# EAGLE design bff-stm32f4-codec (EAGLE 9.4.2)
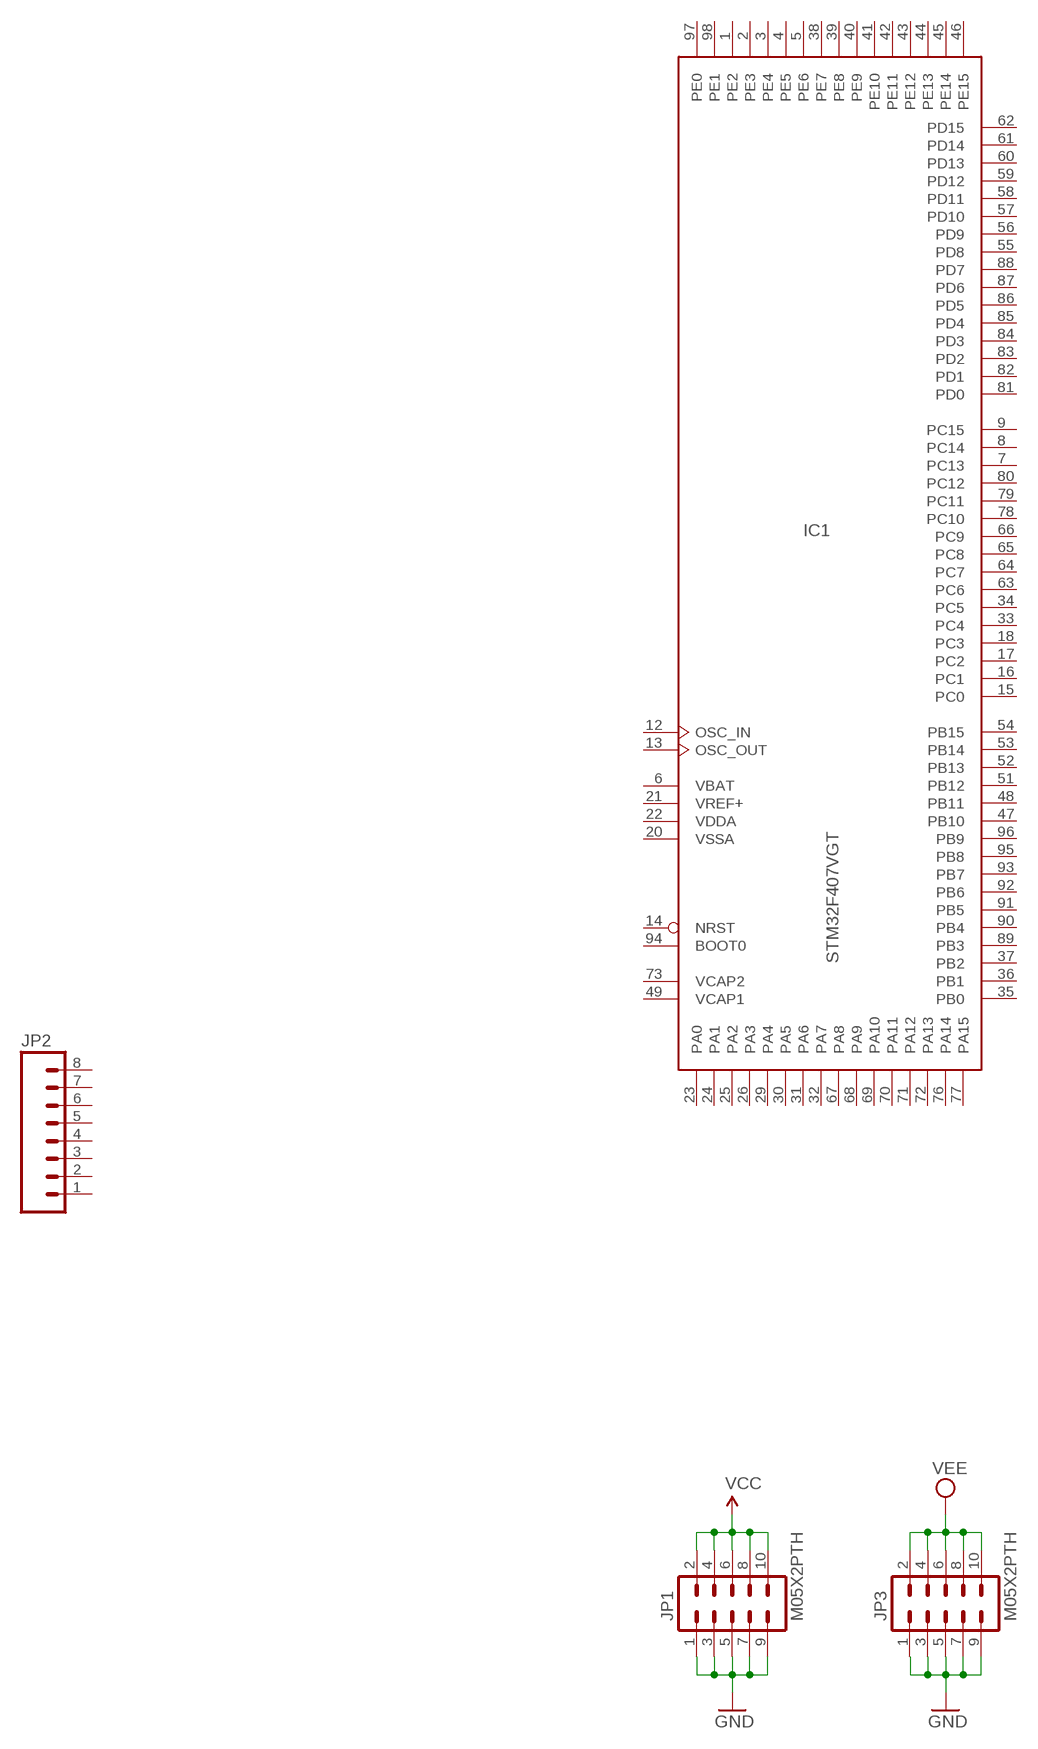
[diagram p0: schematic, sheet 1]

## Parts
IC1  STM32F407VGT  [LQFP100]
JP1  M05X2PTH  [AVR_ICSP]
JP2  M08  [1X08]
JP3  M05X2PTH  [AVR_ICSP]

## Nets
GND: JP1.1 JP1.3 JP1.5 JP1.7 JP1.9 JP3.1 JP3.3 JP3.5 JP3.7 JP3.9
VCC: JP1.2 JP1.4 JP1.6 JP1.8 JP1.10
VEE: JP3.2 JP3.4 JP3.6 JP3.8 JP3.10
Unconnected: IC1.1(PE2) IC1.2(PE3) IC1.3(PE4) IC1.4(PE5) IC1.5(PE6) IC1.7(PC13) IC1.8(PC14) IC1.9(PC15) IC1.12(OSC_IN) IC1.13(OSC_OUT) IC1.14(NRST) IC1.15(PC0) IC1.16(PC1) IC1.17(PC2) IC1.18(PC3) IC1.23(PA0) IC1.24(PA1) IC1.25(PA2) IC1.26(PA3) IC1.29(PA4) IC1.30(PA5) IC1.31(PA6) IC1.32(PA7) IC1.33(PC4) IC1.34(PC5) IC1.35(PB0) IC1.36(PB1) IC1.37(PB2) IC1.38(PE7) IC1.39(PE8) IC1.40(PE9) IC1.41(PE10) IC1.42(PE11) IC1.43(PE12) IC1.44(PE13) IC1.45(PE14) IC1.46(PE15) IC1.47(PB10) IC1.48(PB11) IC1.51(PB12) IC1.52(PB13) IC1.53(PB14) IC1.54(PB15) IC1.55(PD8) IC1.56(PD9) IC1.57(PD10) IC1.58(PD11) IC1.59(PD12) IC1.60(PD13) IC1.61(PD14) IC1.62(PD15) IC1.63(PC6) IC1.64(PC7) IC1.65(PC8) IC1.66(PC9) IC1.67(PA8) IC1.68(PA9) IC1.69(PA10) IC1.70(PA11) IC1.71(PA12) IC1.72(PA13) IC1.76(PA14) IC1.77(PA15) IC1.78(PC10) IC1.79(PC11) IC1.80(PC12) IC1.81(PD0) IC1.82(PD1) IC1.83(PD2) IC1.84(PD3) IC1.85(PD4) IC1.86(PD5) IC1.87(PD6) IC1.88(PD7) IC1.89(PB3) IC1.90(PB4) IC1.91(PB5) IC1.92(PB6) IC1.93(PB7) IC1.94(BOOT0) IC1.95(PB8) IC1.96(PB9) IC1.97(PE0) IC1.98(PE1) JP2.1 JP2.2 JP2.3 JP2.4 JP2.5 JP2.6 JP2.7 JP2.8

## Power pins joined to a net without a drawn wire
VBAT: IC1.6(VBAT)
VCAP1: IC1.49(VCAP1)
VCAP2: IC1.73(VCAP2)
VDD: IC1.11(VDD) IC1.19(VDD) IC1.28(VDD) IC1.50(VDD) IC1.75(VDD) IC1.100(VDD)
VDDA: IC1.22(VDDA)
VREF+: IC1.21(VREF+)
VSS: IC1.10(VSS) IC1.27(VSS) IC1.74(VSS) IC1.99(VSS)
VSSA: IC1.20(VSSA)

## Library data of the parts
IC1 = micro-stm_v3:STM32F407V*T: ARM 32-bit Cortex™-M3 CPU 168 MHz maximum frequency 512 to 1024 Kbytes of Flash memory 192 kbytes of SRAM 82 GPIOs 1.8 to 3.6 V application supply
JP1 JP3 = SparkFun:M05X2: Header 5x2 Standard 10-pin dual row 0.1" header. Commonly used with AVR-ISP. Use with Spark Fun Electronics SKU: PRT-00778
JP2 = SparkFun:M08: Header 8 Standard 8-pin 0.1" header. Use with straight break away headers (SKU : PRT-00116), right angle break away headers (PRT-00553), swiss pins (PRT-00743), machine pins (PRT-00117), and female headers (PRT-00115).

## Net classes
0 default: width 0.305 mm, drill 0.508 mm, clearance 0.254 mm

## Board
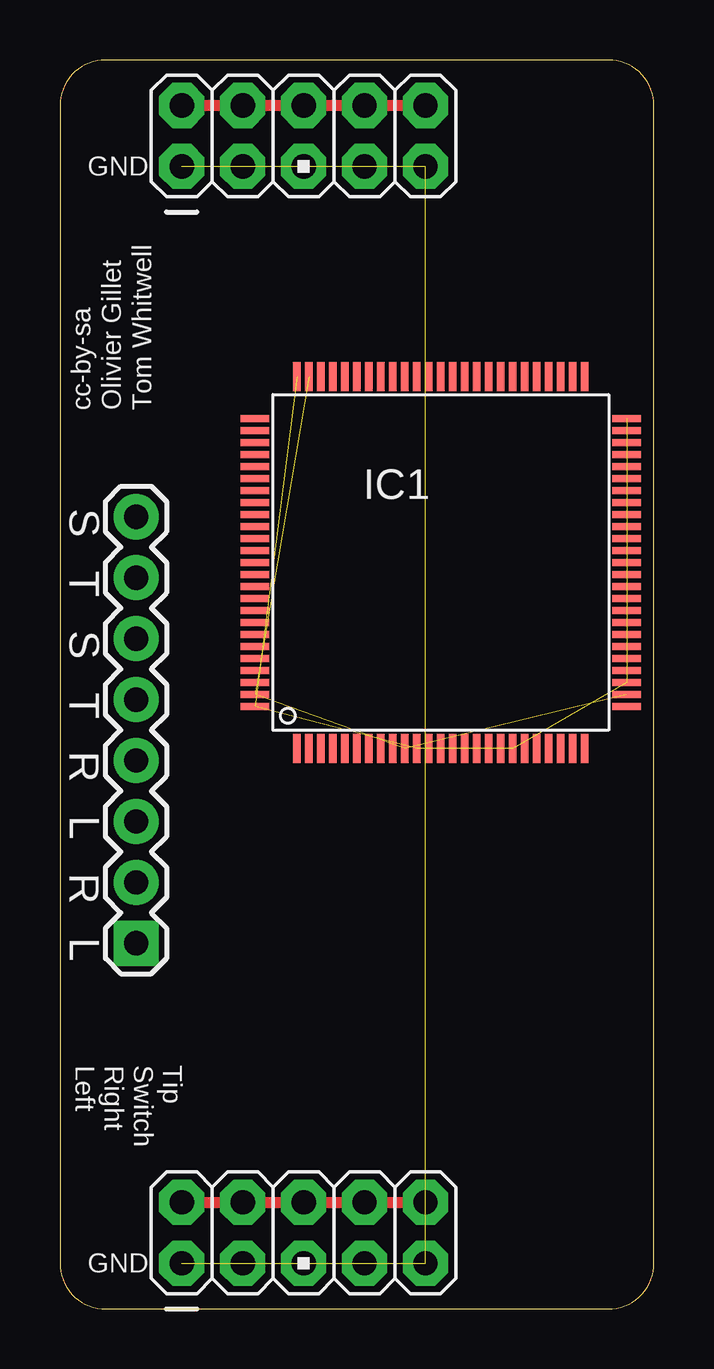
[diagram p1: board, top side]
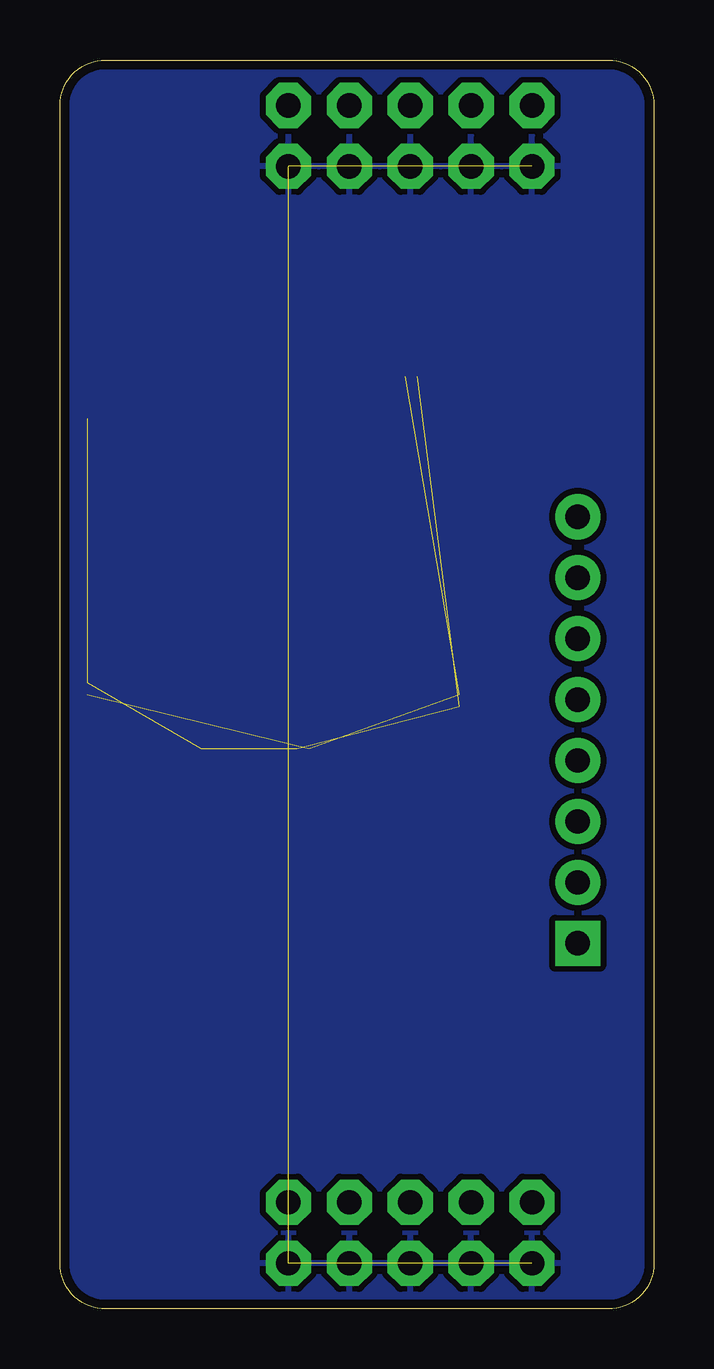
[diagram p2: board, bottom side, seen from below]

Size 24.76 x 52.06 mm. Coordinates in mm from the lower left corner, seen from the top.
Outline: 22.86,0 arc90 24.76,1.91 24.76,50.16 arc90 22.87,52.06 1.89,52.06 arc90 0,50.16 0,1.91 arc90 1.91,0 22.86,0
Copper layers (1*16): Top 0.035559375mm / dielectric 1.6mm / Bottom 0.035559375mm
Design rules "oshpark-2layer": minimum track width 6mil, minimum drill 10mil, track to track 6mil, track to pad 6mil, pad to pad 6mil, via to via 6mil, smd to smd 6mil, copper to edge 15mil, drill to drill 6mil, minimum pad ring 5mil, minimum via ring 5mil, stop-mask expansion 2.5mil, vias tented up to drill 0mil, thermal gap 10mil

### Footprints (pad centres in the part's own frame; a part is rotated, then mirrored left to right if it is on the bottom)
LQFP100 = smd 0.3 x 1.2: 1 -6,-7.75; 2 -5.5,-7.75; 3 -5,-7.75; 4 -4.5,-7.75; 5 -4,-7.75; 6 -3.5,-7.75; 7 -3,-7.75; 8 -2.5,-7.75; 9 -2,-7.75; 10 -1.5,-7.75; 11 -1,-7.75; 12 -0.5,-7.75; 13 0,-7.75; 14 0.5,-7.75; 15 1,-7.75; 16 1.5,-7.75; 17 2,-7.75; 18 2.5,-7.75; 19 3,-7.75; 20 3.5,-7.75; 21 4,-7.75; 22 4.5,-7.75; 23 5,-7.75; 24 5.5,-7.75; 25 6,-7.75; 51 6,7.75; 52 5.5,7.75; 53 5,7.75; 54 4.5,7.75; 55 4,7.75; 56 3.5,7.75; 57 3,7.75; 58 2.5,7.75; 59 2,7.75; 60 1.5,7.75; 61 1,7.75; 62 0.5,7.75; 63 0,7.75; 64 -0.5,7.75; 65 -1,7.75; 66 -1.5,7.75; 67 -2,7.75; 68 -2.5,7.75; 69 -3,7.75; 70 -3.5,7.75; 71 -4,7.75; 72 -4.5,7.75; 73 -5,7.75; 74 -5.5,7.75; 75 -6,7.75 | smd 1.2 x 0.3: 26 7.75,-6; 27 7.75,-5.5; 28 7.75,-5; 29 7.75,-4.5; 30 7.75,-4; 31 7.75,-3.5; 32 7.75,-3; 33 7.75,-2.5; 34 7.75,-2; 35 7.75,-1.5; 36 7.75,-1; 37 7.75,-0.5; 38 7.75,0; 39 7.75,0.5; 40 7.75,1; 41 7.75,1.5; 42 7.75,2; 43 7.75,2.5; 44 7.75,3; 45 7.75,3.5; 46 7.75,4; 47 7.75,4.5; 48 7.75,5; 49 7.75,5.5; 50 7.75,6; 76 -7.75,6; 77 -7.75,5.5; 78 -7.75,5; 79 -7.75,4.5; 80 -7.75,4; 81 -7.75,3.5; 82 -7.75,3; 83 -7.75,2.5; 84 -7.75,2; 85 -7.75,1.5; 86 -7.75,1; 87 -7.75,0.5; 88 -7.75,0; 89 -7.75,-0.5; 90 -7.75,-1; 91 -7.75,-1.5; 92 -7.75,-2; 93 -7.75,-2.5; 94 -7.75,-3; 95 -7.75,-3.5; 96 -7.75,-4; 97 -7.75,-4.5; 98 -7.75,-5; 99 -7.75,-5.5; 100 -7.75,-6
AVR_ICSP = drill 1.016 pad 1.88 octagon: 1 -1.27,5.08; 2 1.27,5.08; 3 -1.27,2.54; 4 1.27,2.54; 5 -1.27,0; 6 1.27,0; 7 -1.27,-2.54; 8 1.27,-2.54; 9 -1.27,-5.08; 10 1.27,-5.08
1X08 = drill 1.016 pad 1.88 square: 1 0,0 | drill 1.016 pad 1.88: 2 2.54,0; 3 5.08,0; 4 7.62,0; 5 10.16,0; 6 12.7,0; 7 15.24,0; 8 17.78,0

### Placement (x,y rotation side)
IC1  15.88,31.11 0 top
JP1  10.16,48.9 90 top
JP2  3.17,15.24 90 top
JP3  10.16,3.17 90 top

### Tracks (layer width: path | path; a pad name or v marks a point on that pad's centre or on a via)
GND  (9 unrouted)
  pour Bottom: 22.86,0 arc90 24.76,1.91 24.76,50.16 arc90 22.86,52.07 1.91,52.07 arc90 0,50.16 0,1.91 arc90 1.91,0
VCC
  Top 0.457: JP1.2 JP1.4 JP1.6 JP1.8 JP1.10
VDD  (5 unrouted)
VEE
  Top 0.457: JP3.2 JP3.4 JP3.6 JP3.8 JP3.10
VSS  (3 unrouted)

### Text on the board
tPlace: GND | S | T | S | T | R | L | R | L | GND
tNames: cc-by-sa | Olivier Gillet | Tom Whitwell | Tip / Switch / Right / Left